# EAGLE schematic Excercise_001_Completed (EAGLE 8.2.1)
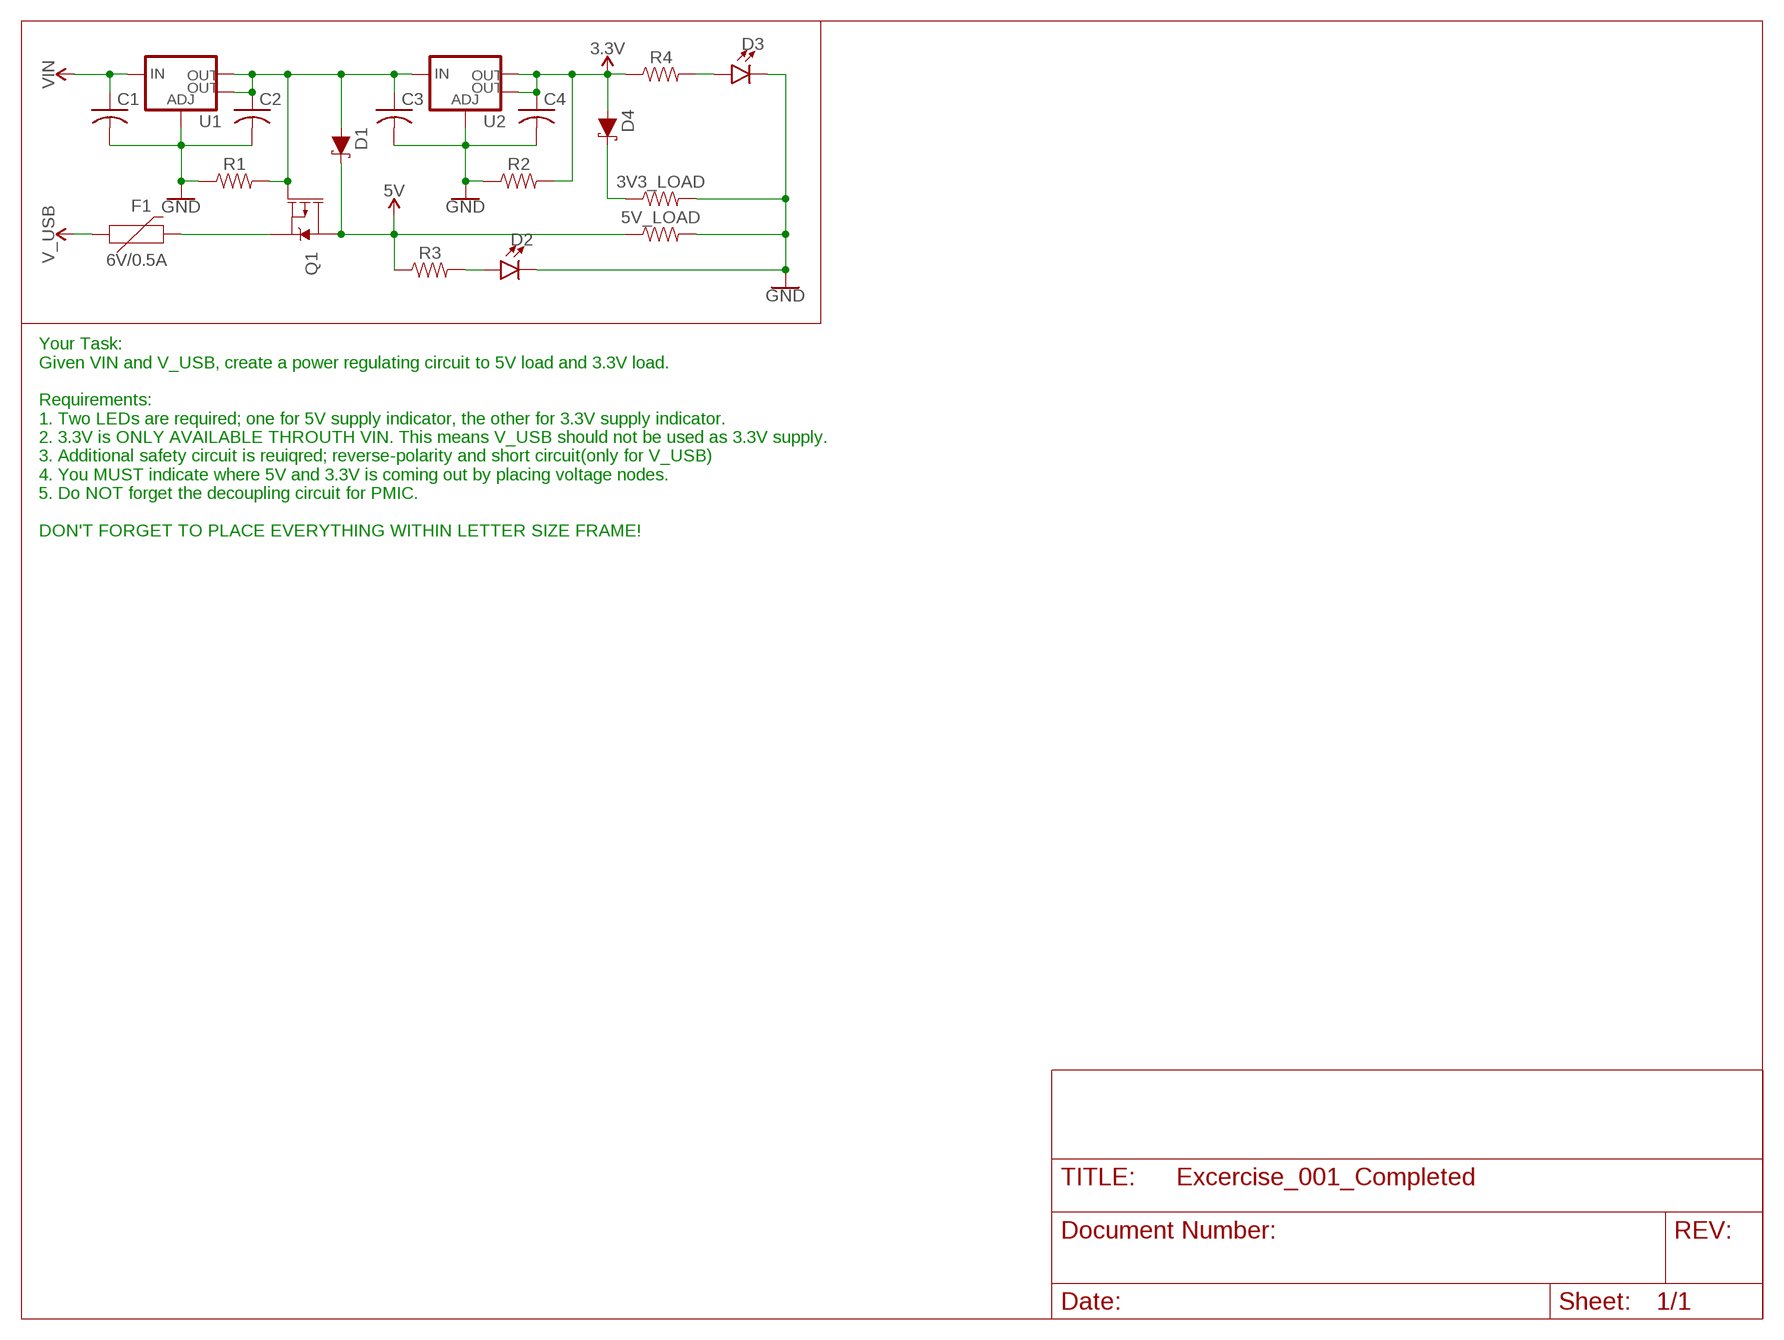
[diagram p0: schematic, sheet 1]

## Parts
3V3_LOAD  RESISTOR0805  [0805]
5V_LOAD  RESISTOR0805  [0805]
C1  C-USC0805  [C0805]
C2  C-USC0805  [C0805]
C3  C-USC0805  [C0805]
C4  C-USC0805  [C0805]
D1  DIODE-SCHOTTKY-B340A  [SMA-DIODE]
D2  LED5MM  [LED_5MM]
D3  LED5MM  [LED_5MM]
D4  DIODE-SCHOTTKY-B340A  [SMA-DIODE]
F1  6V/0.5A  PPTC_HALF-AMP  [1206]
Q1  MOSFET_PCH-NDP6020P  [TO220V]
R1  RESISTOR0805  [0805]
R2  RESISTOR0805  [0805]
R3  RESISTOR0805  [0805]
R4  RESISTOR0805  [0805]
U1  V_REG_LM1117SOT223  [SOT223]
U2  V_REG_LM1117SOT223  [SOT223]

## Nets
3.3V: C4.1 D4.A R2.2 R4.1 U2.2(OUT) U2.4(OUT)
5V: 5V_LOAD.1 D1.C Q1.2(D) R3.1
GND: 3V3_LOAD.2 5V_LOAD.2 C1.2 C2.2 C3.2 C4.2 D2.K(C) D3.K(C) R1.1 R2.1 U1.1(ADJ) U2.1(ADJ)
N$1: 3V3_LOAD.1 D4.C
N$2: C2.1 C3.1 D1.A Q1.1(G) R1.2 U1.2(OUT) U1.4(OUT) U2.3(IN)
N$3: D2.A R3.2
N$4: F1.2 Q1.3(S)
N$5: D3.A R4.2
V_USB: F1.1
VIN: C1.1 U1.3(IN)

## Notes on the sheet
- Your Task:
  Given VIN and V_USB, create a power regulating circuit to 5V load and 3.3V load.
  
  Requirements:
  1. Two LEDs are required; one for 5V supply indicator, the other for 3.3V supply indicator.
  2. 3.3V is ONLY AVAILABLE THROUTH VIN. This means V_USB should not be used as 3.3V supply.
  3. Additional safety circuit is reuiqred; reverse-polarity and short circuit(only for V_USB)
  4. You MUST indicate where 5V and 3.3V is coming out by placing voltage nodes.
  5. Do NOT forget the decoupling circuit for PMIC.
  
  DON'T FORGET TO PLACE EVERYTHING WITHIN LETTER SIZE FRAME!

## Library data of the parts
3V3_LOAD 5V_LOAD R1-R4 = SparkFun-Resistors:RESISTOR: Generic Resistor Package
C1-C4 = adafruit:C-US: CAPACITOR, American symbol
D1 D4 = SparkFun-DiscreteSemi:DIODE-SCHOTTKY: Schottky diode A Schottky diode is a semiconductor diode which has a low forward voltage drop and a very fast switching action.; PROD_ID: DIO-09886; VALUE: 3A/40V/500mV
D2 D3 = SparkFun-LED:LED: LED (Generic) Standard schematic elements and footprints for 5mm, 3mm, 1206, and 0603 sized LEDs. Generic LEDs with no color specified.
F1 = SparkFun-Fuses:PPTC: Resettable Fuse PPTC Resettable Fuse. Really a sort of resistor with a polymeric positive temperature coefficient whose resistance increases dramatically with an increase in temperature. When heated by the power passing through the resistance rises causing the current to be limited, protecting the circuit. This is achieved by the transition of the polymer from a crystalline to an amorphous state where the conductive carbon separates breaking the conductive pathways found in the cool crystalline structure. When a PPTC cools back down it resumes conducting letting the circuit turn back on. SparkFun Products: SparkFun RedBoard - Programmed with Arduino <https://www.sparkfun.com/products/12757> Pro Micro - 5V/16MHz <https://www.sparkfun.com/products/12640> Arduino Pro 328 - 5V/16MHz <https://www.sparkfun.com/products/10915> MP3 Trigger <https://www.sparkfun.com/products/13720>; PROD_ID: RES-08585
Q1 = SparkFun-DiscreteSemi:MOSFET_PCH: P-channel MOSFETs Voltage controlled devices that allow control of high current outputs. SparkFun Products: SparkFun ESP32 Thing <https://www.sparkfun.com/products/13907> SparkFun ESP8266 Thing <https://www.sparkfun.com/products/13231>; PROD_ID: TRANS-13060; VALUE: 24A/20V/50mΩ
U1 U2 = SparkFun-IC-Power:V_REG_LM1117: Voltage Regulator LM1117 Standard adjustable voltage regulator but in SMD form. Spark Fun Electronics SKU : COM-00595; PROD_ID: VREG-08170